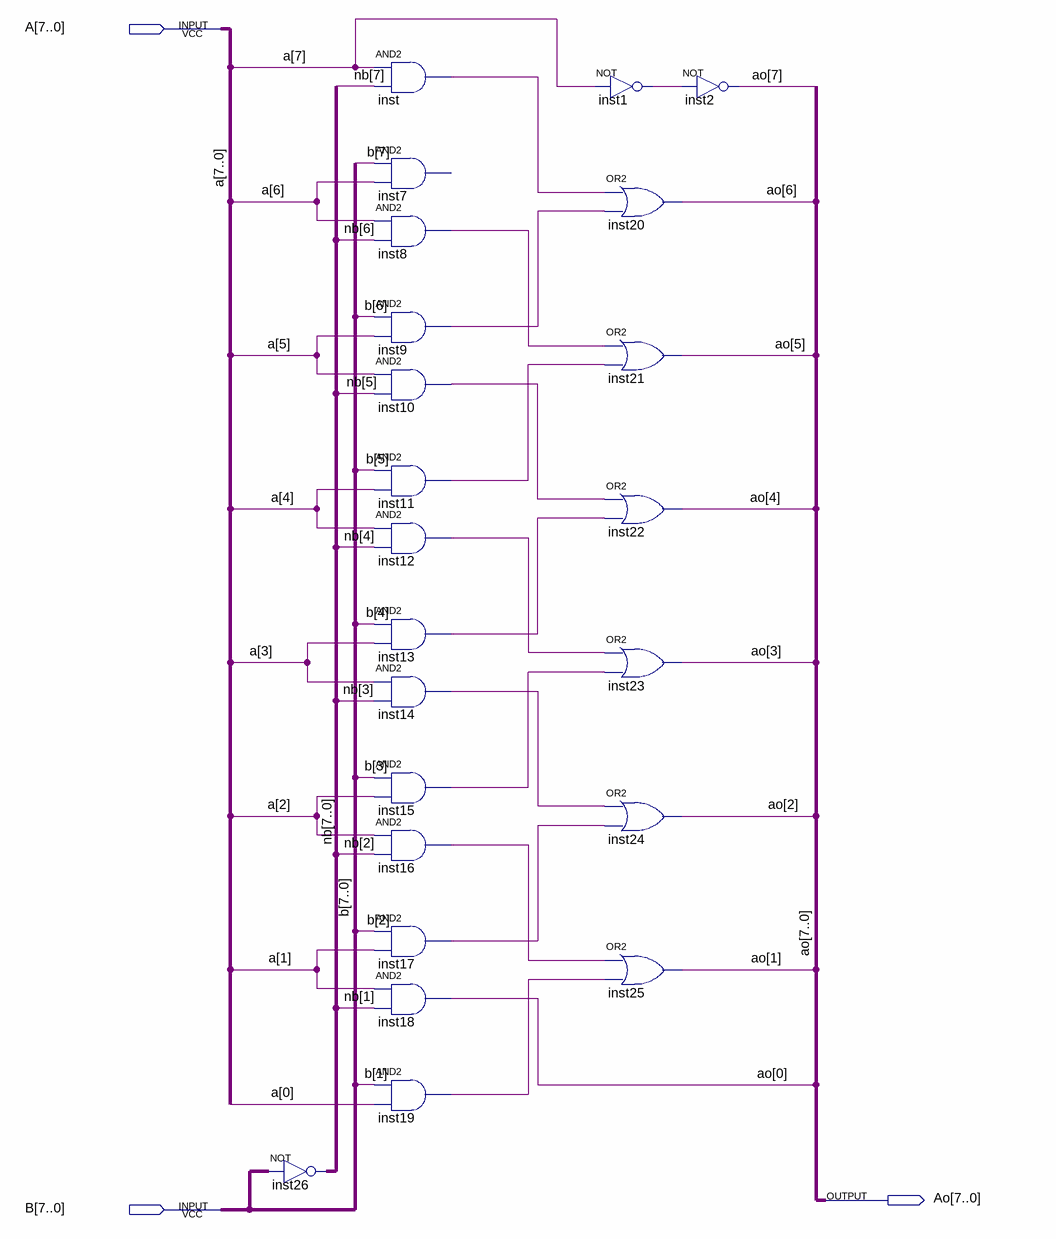
[diagram p0: schematic sheet]
// Quartus schematic SHRA_ALU.bdf as structural Verilog: 23 symbols, 3 pins
module SHRA_ALU (
  input  [7:0] A,
  input  [7:0] B,
  output [7:0] Ao
);

  wire inst1_out, inst8_out, inst9_out, inst10_out, inst11_out, inst12_out, inst13_out, inst14_out,
       inst15_out, inst16_out, inst17_out, inst19_out, inst_out;
  wire [7:0] nb;

  assign nb = ~B;  // NOT inst26, 8 bits wide
  and inst (inst_out, A[7], nb[7]);
  // AND2 inst7 has open pins: IN1=B[7], IN2=A[6], OUT=open
  and inst8 (inst8_out, A[6], nb[6]);
  and inst9 (inst9_out, B[6], A[5]);
  and inst10 (inst10_out, A[5], nb[5]);
  and inst11 (inst11_out, B[5], A[4]);
  and inst12 (inst12_out, A[4], nb[4]);
  and inst13 (inst13_out, B[4], A[3]);
  and inst14 (inst14_out, A[3], nb[3]);
  and inst15 (inst15_out, B[3], A[2]);
  and inst16 (inst16_out, A[2], nb[2]);
  and inst17 (inst17_out, B[2], A[1]);
  and inst18 (Ao[0], A[1], nb[1]);
  and inst19 (inst19_out, B[1], A[0]);
  not inst1 (inst1_out, A[7]);
  or inst20 (Ao[6], inst_out, inst9_out);
  or inst21 (Ao[5], inst8_out, inst11_out);
  or inst22 (Ao[4], inst10_out, inst13_out);
  or inst23 (Ao[3], inst12_out, inst15_out);
  or inst24 (Ao[2], inst14_out, inst17_out);
  or inst25 (Ao[1], inst16_out, inst19_out);
  not inst2 (Ao[7], inst1_out);
endmodule
